# Altium schematic sheet GPS.SchDoc
size 254 x 228 mm; DocumentNumber: 12; SheetNumber: 12; SheetTotal: 15; PageSetup: Record=PageOptions|CenterHorizontal=True|CenterVertical=True|PrintScale=0.87|XCorrection=1.00|YCorrection=1.00|PrintKind=1|BorderSize=5000000|LeftOffset=0|BottomOffset=0|Orientation=2|PaperLength=1000|PaperWidth=1000|Scale=100|PaperSource=257|PrintQuality=600|MediaType=1|DitherType=10|PrintScaleMode=1|PaperKind=A4|PaperIndex=9
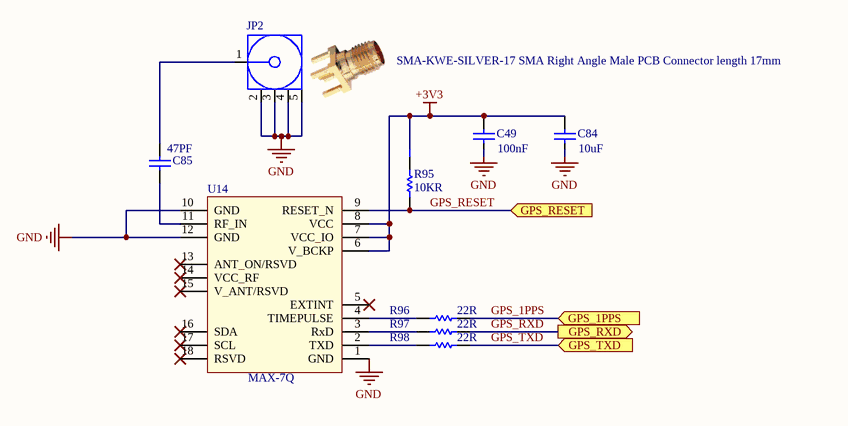
[diagram p0: GPS.SchDoc]

## Parts
C49  100nF  [C0603E]
C84  10uF  [C0805E]
C85  47PF  [C0603E]
JP2  SMA-KWE-SILVER-17 SMA Right Angle Male PCB Connector length 17mm  [SMA_R]
R95  10KR  [R0603E]
R96  22R  [R0603E]
R97  22R  [R0603E]
R98  22R  [R0603E]
U14  Part Number: MAX-7Q  [MAX]  (hidden comment: GPS_MAX-7Q)

## Ports
GPS_1PPS (in), GPS_RESET (in), GPS_RXD (out), GPS_TXD (in)

## Nets
+3V3: C49.1 C84.1 R95.2 U14.6(V_BCKP) U14.7(VCC_IO) U14.8(VCC)
GND: C49.2 C84.2 JP2.2(GND) JP2.3(GND) JP2.4(GND) JP2.5(GND) U14.1(GND) U14.10(GND) U14.12(GND)
GPS_1PPS: R96.2 ; port GPS_1PPS
GPS_RESET: R95.1 U14.9(RESET_N) ; port GPS_RESET
GPS_RXD: R97.2 ; port GPS_RXD
GPS_TXD: R98.2 ; port GPS_TXD
NetC85_1: C85.1 JP2.1(Signal)
NetC85_2: C85.2 U14.11(RF_IN)
NetR96_1: R96.1 U14.4(TIMEPULSE)
NetR97_1: R97.1 U14.3(RxD)
NetR98_1: R98.1 U14.2(TXD)

Not connected (* = marked no-connect by the designer): U14 5(EXTINT)* 13(ANT_ON/RSVD)* 14(VCC_RF)* 15(V_ANT/RSVD)* 16(SDA)* 17(SCL)* 18(RSVD)*

## Library data of the parts
C49 C85 = Cap: Chip Monolithic Ceramic Capacitor; SMD; Manufacturer: Murata Electronics North America; Manufacturer Part Number: GRM188R71C104KA01D; Current Footprint: 0603 (1608 Metric); Board Qty: 100; PCB Name: Main_PCB; Packing List: CL10B104KB8NNNC; ComponentLink1Description: Datasheet; HelpURL: D:\HNA\Datasheet Documents\c02e.pdf; ComponentLink1URL: D:\HNA\Datasheet Documents\c02e.pdf; Mounting Type: Surface Mount; Supplier: NULL; Supplier Part Number: NULL; Pricing: NULL; Package / Case: 0603 (1608 Metric); Size / Dimension: NULL; Description1: Chip Monolithic Ceramic Capacitor; SMD
  C49: Part Number: 100nF
  C85: Part Number: 47PF
C84 = Cap: Chip Monolithic Ceramic Capacitor; SMD; Manufacturer: Murata Electronics North America; Manufacturer Part Number: GRM188R71C104KA01D; Current Footprint: 0805 (2012 Metric); Board Qty: 100; PCB Name: Main_PCB; Packing List: CL10B104KB8NNNC; ComponentLink1Description: Datasheet; HelpURL: D:\HNA\Datasheet Documents\c02e.pdf; ComponentLink1URL: D:\HNA\Datasheet Documents\c02e.pdf; Mounting Type: Surface Mount; Supplier: NULL; Part Number: 10uF; Supplier Part Number: NULL; Pricing: NULL; Package / Case: 0805 (2012 Metric); Size / Dimension: NULL; Description1: Chip Monolithic Ceramic Capacitor; SMD
JP2 = 19-46-2-TGG: CONN RP-SMA JACK R/A 50 OHM PCB MALE PIN-SILVER; Manufacturer-1: Linx Technologies Inc.; Manufacturer Part Number-1: CONREVSMA002-L; Manufacturer: China; Manufacturer Part Number: SMA-KWE-17 SMA Right Angle Male PCB Connector length 17mm; Current Footprint: THD; Board Qty: 100; Impedance: 50 Ohm; Contact Termination: Solder; Connector Type: Receptacle, Male Pin; Center Contact Material: Brass; Body Finish: Nickel; Dielectric Material: Polytetrafluoroethylene (PTFE); Center Contact Plating: Gold; Package / Case: THD; Part Number-1: CONREVSMA002-L; Pricing: 1=4.12, 25=3.8, 100=3.43, 500=3.25 (USD); Supplier: Digi-Key; Supplier Part Number: CONREVSMA002-L-ND; HelpURL: D:\HNA\Datasheet Documents\conrevsma002-l.pdf; Category: Connectors, Interconnects; RoHS: RoHS Compliant; Packaging: Bulk; Part Status: Active; Connector Style: RP-SMA; Frequency - Max: -; Mounting Type: Panel Mount, Bulkhead; Through Hole, Right Angle; Features: -; Housing Color: Silver; Cable Group: -; Shield Termination: Solder; Fastening Type: Threaded; Voltage Rating: -; Ingress Protection: -; Operating Temperature: -65°C ~ 165°C; Body Material: Brass; Stock: 11366; Part Number: SMA-KWE-SILVER-17 SMA Right Angle Male PCB Connector length 17mm
R95-R98 = Res1: Resistor: thick film; SMD; Manufacturer: Yageo; Manufacturer Part Number: null; Current Footprint: 0603 (1608 Metric); Board Qty: 100; PCB Name: Main_PCB; Packing List: 0603F1002T5E; ComponentLink1Description: Datasheet; HelpURL: D:\HNA\Datasheet Documents\PYu-RC_Group_51_RoHS_L_0.pdf; ComponentLink1URL: D:\HNA\Datasheet Documents\PYu-RC_Group_51_RoHS_L_0.pdf; Mounting Type: Surface Mount; Supplier: NULL; Supplier Part Number: NULL; Pricing: NULL; Description1: Resistor: thick film; SMD; Package / Case: 0603 (1608 Metric); Size / Dimension: NULL
  R95: Part Number: 10KR
  R96-R98: Part Number: 22R
U14 = MAX: GPS chip module EPP0910; Manufacturer-1: ShenZhen Tifull Technology Ltd.; Manufacturer Part Number-1: TF1097U7M3; Manufacturer: NULL; Current Footprint: SMD; PCB Name: Main_PCB; Package / Case: SMD; Part Number-1: MAX-7Q; Pricing: 1=12.00000, 100=12.00000 (USD); Size / Dimension: NULL; Supplier: Octopart; Supplier Part Number: Seeed Studio - 317050009; HelpURL: D:\HNA\Datasheet Documents\u-blox-MAX-7_DataSheet_(GPS.G7-HW-12012)_2.pdf; Part Number-2: TF1097U7M3; Manufacturer Part Number: NULL